# EAGLE schematic WIZ-SM20_005_final (EAGLE 6.5.0)
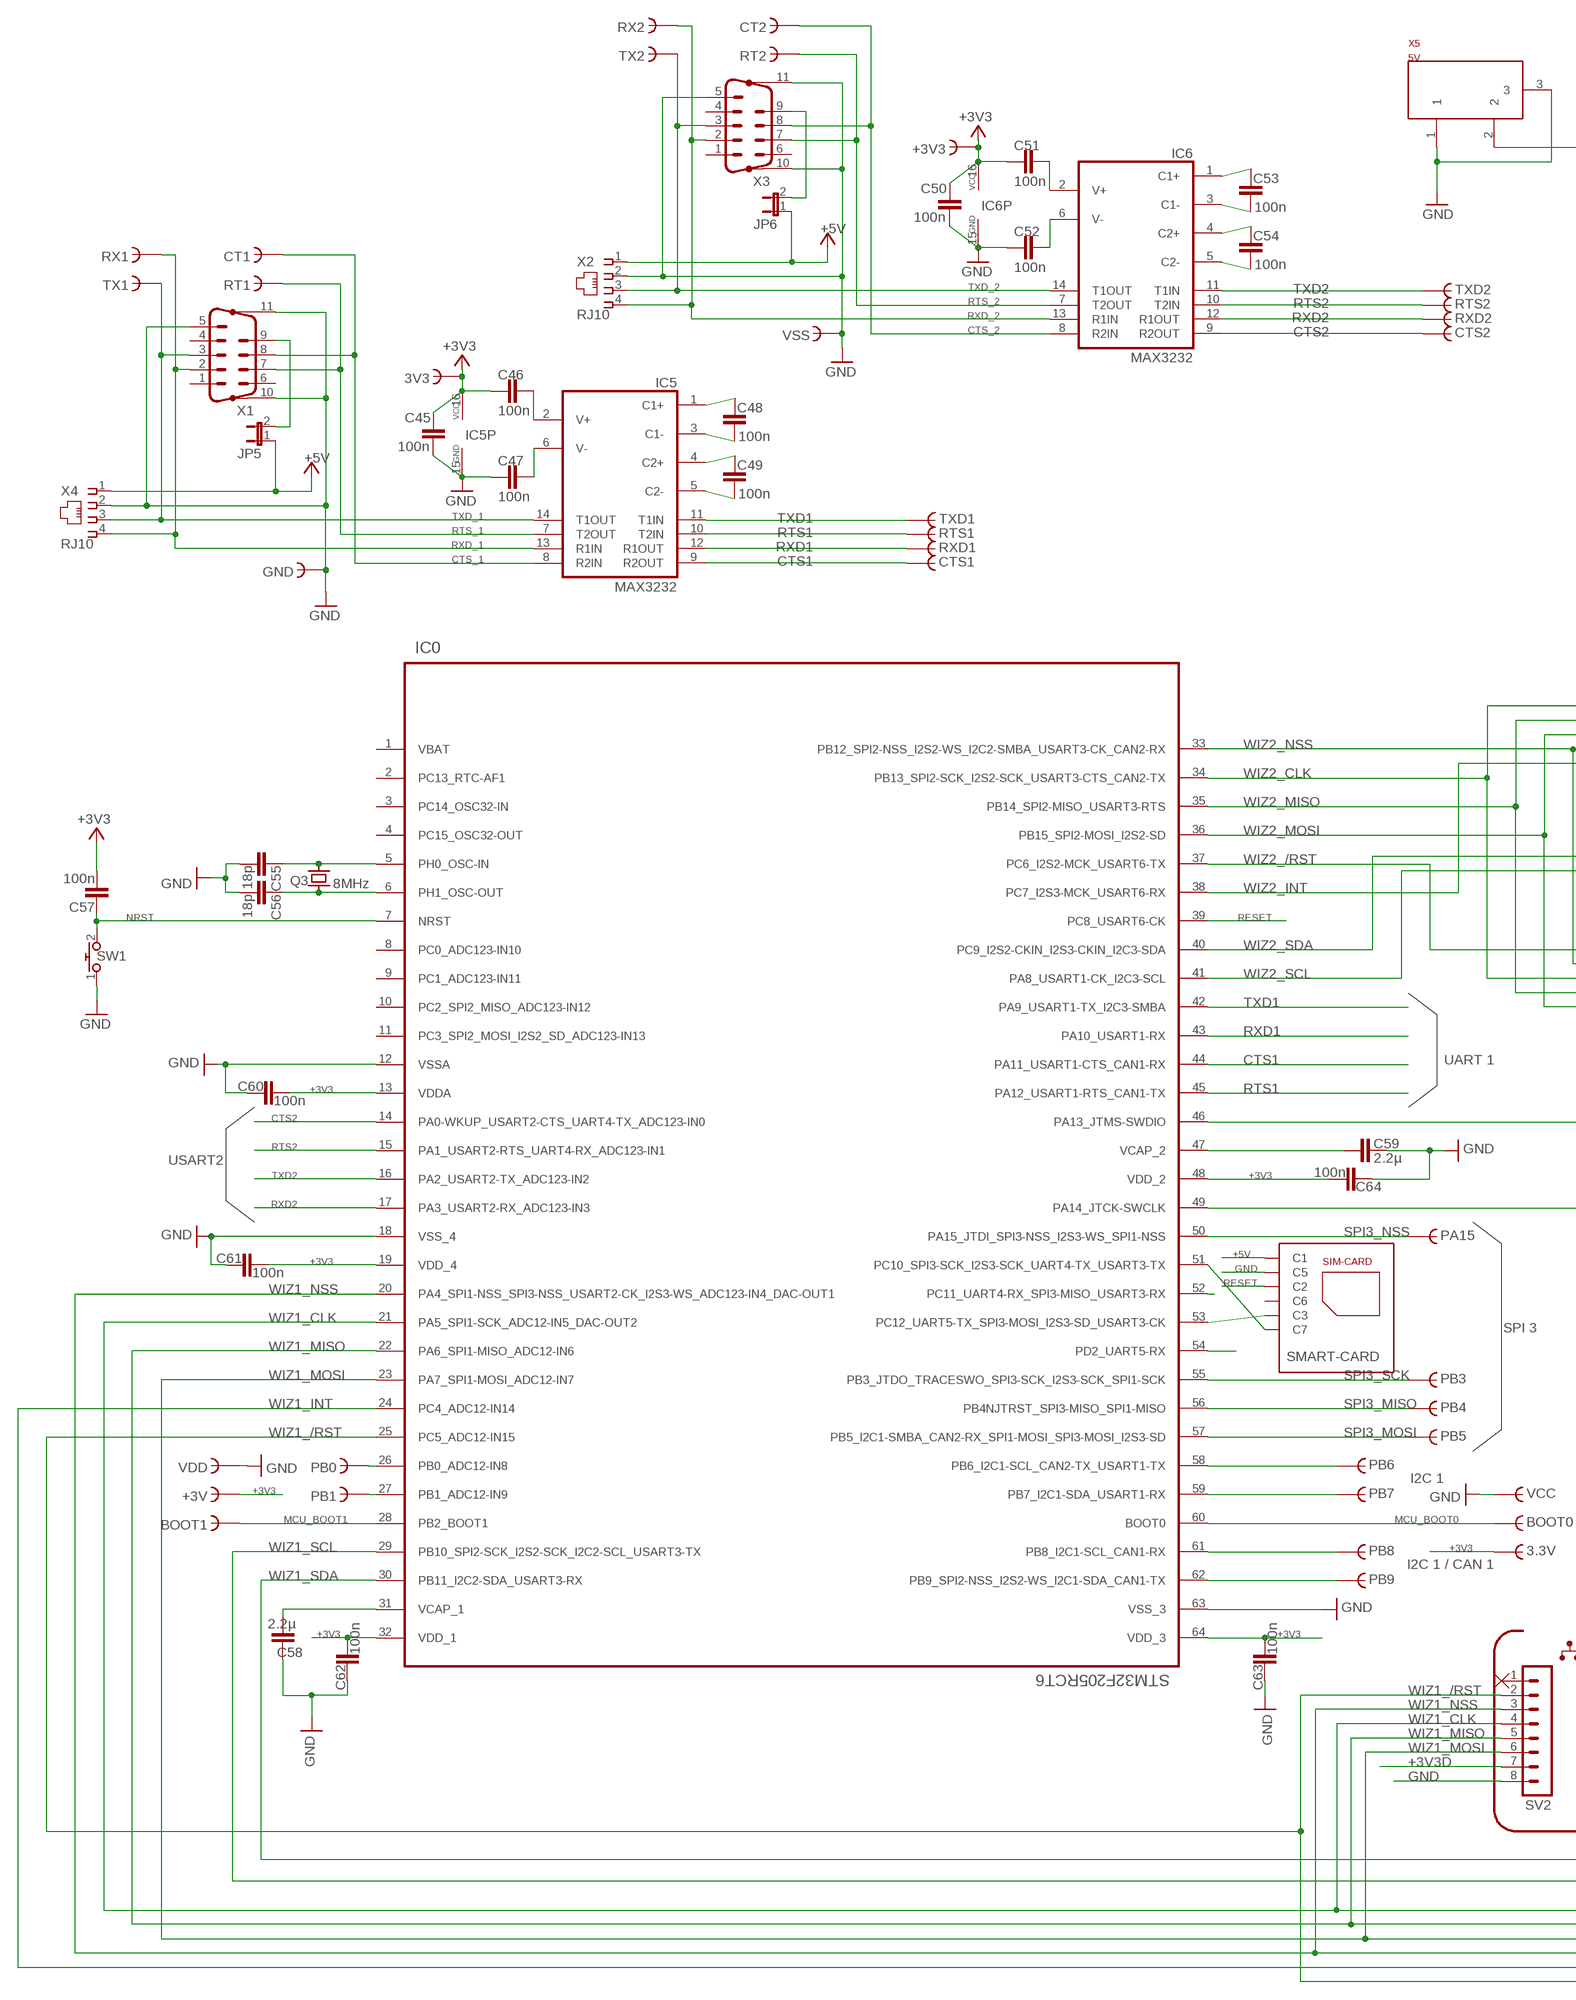
[diagram p0: schematic, sheet 1, part 1 of 2]
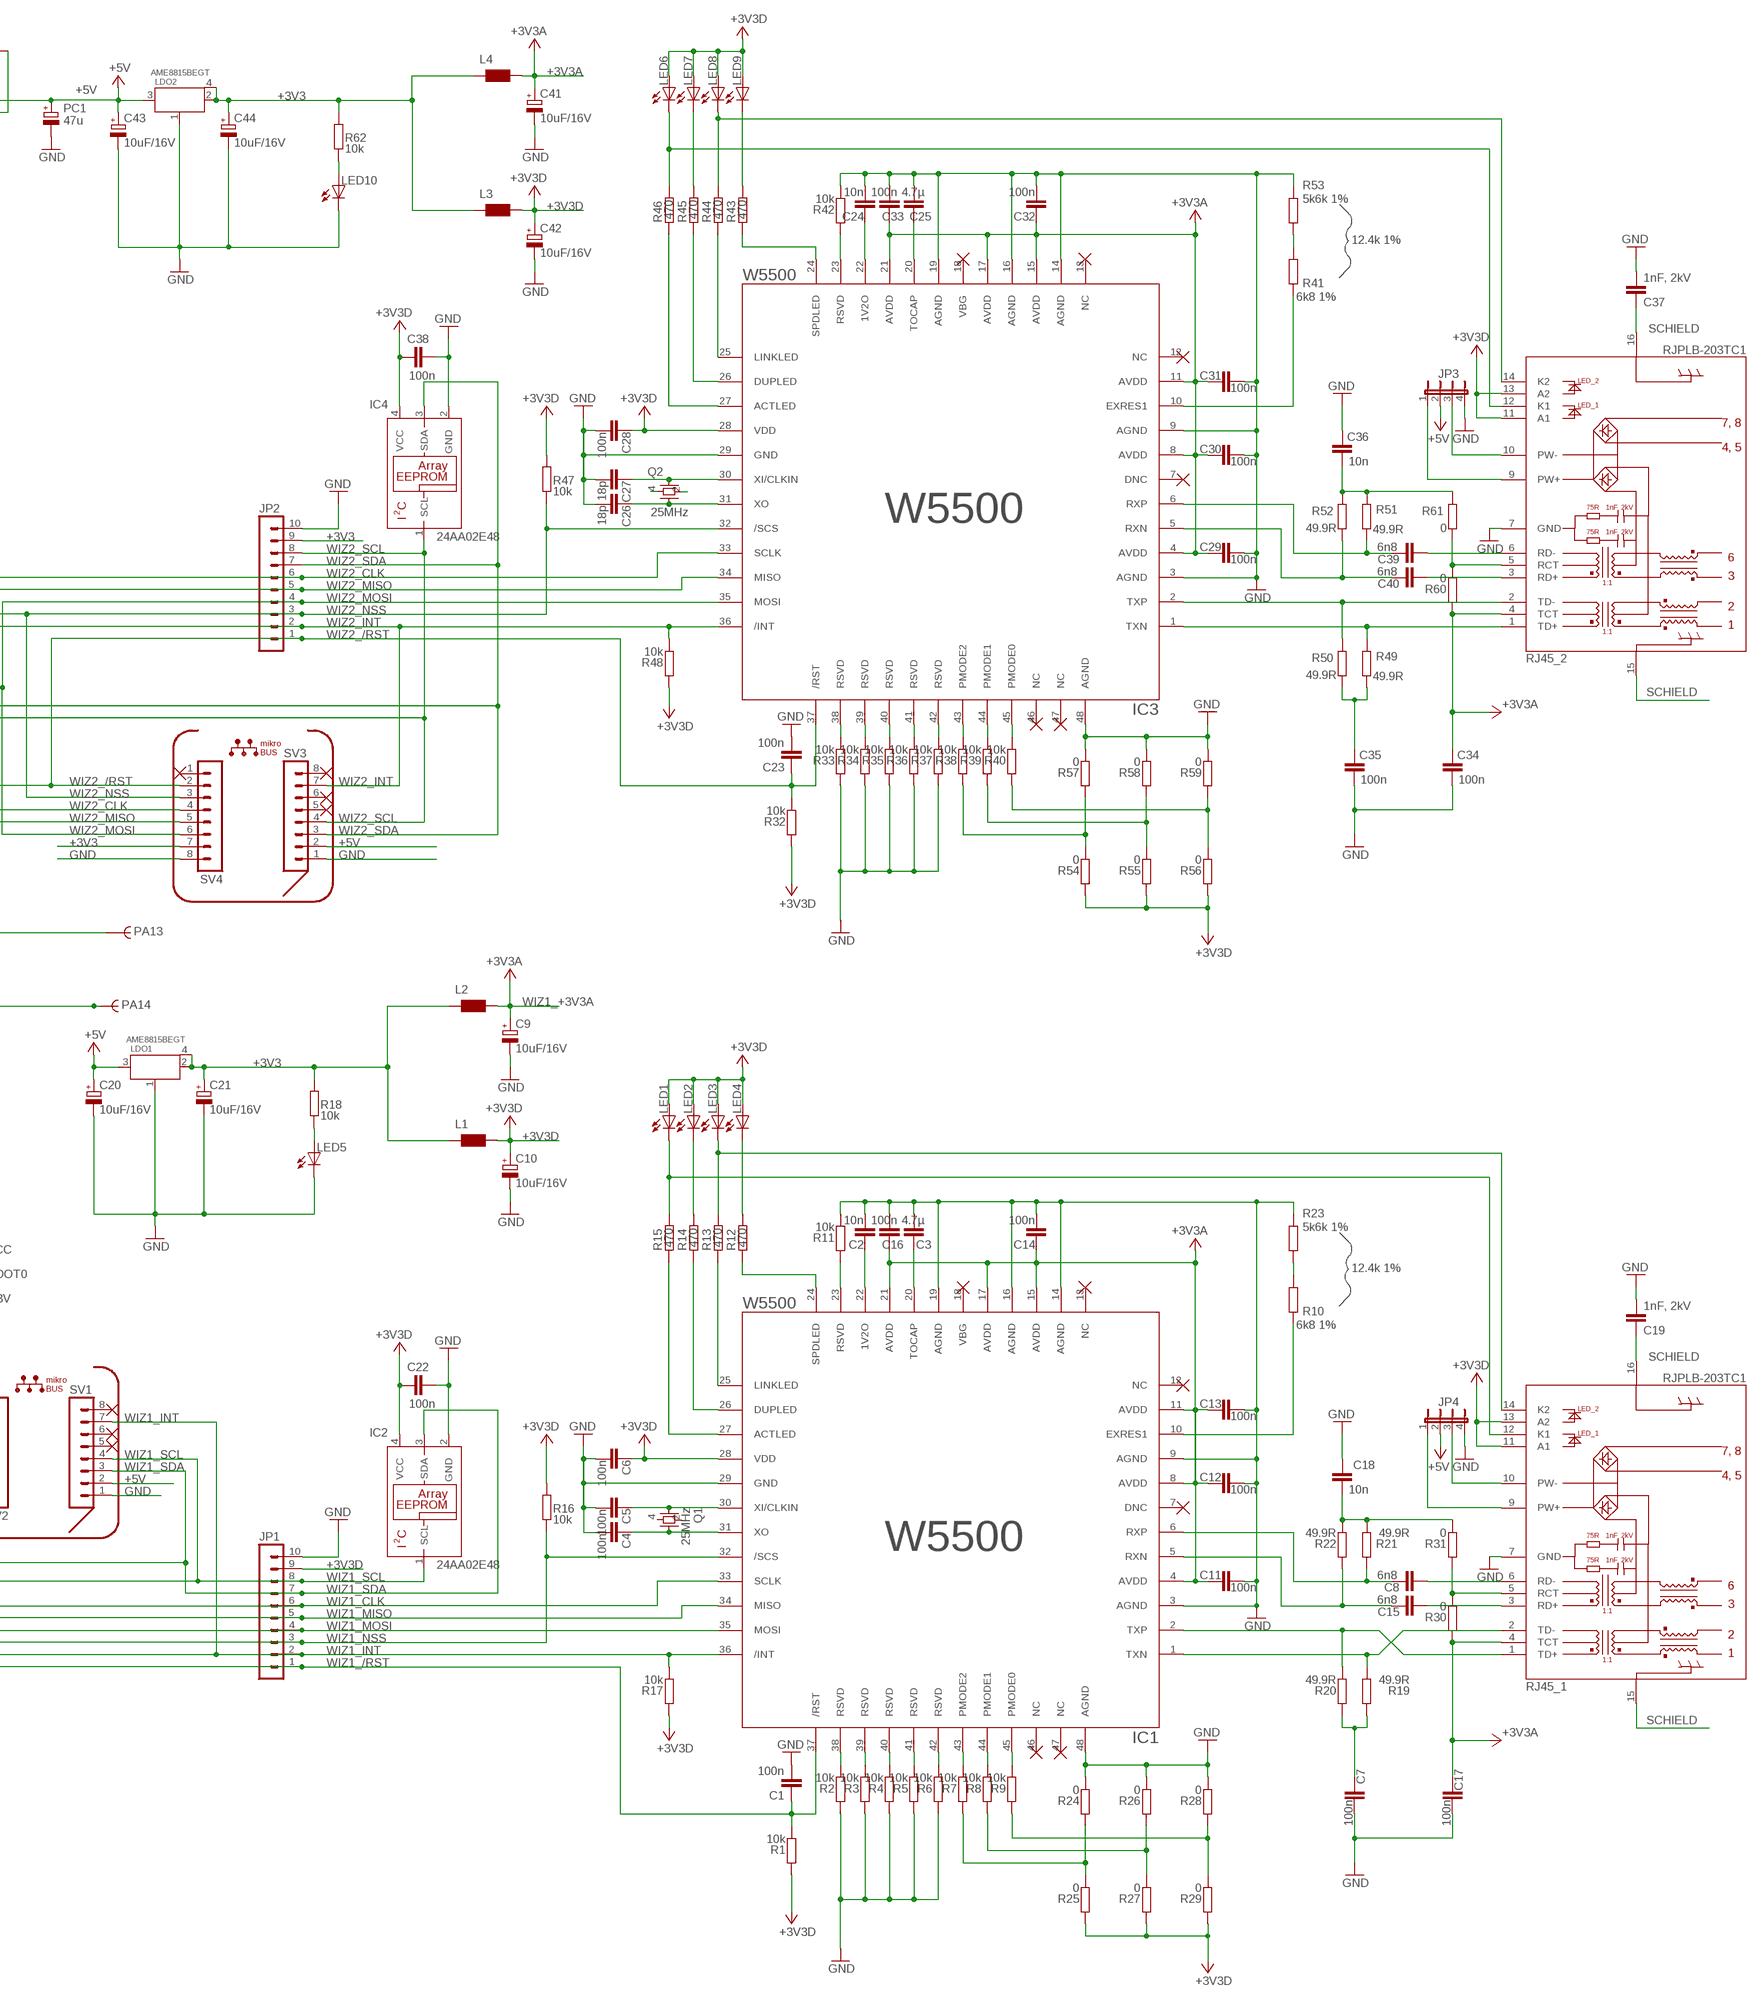
[diagram p1: schematic, sheet 1, part 2 of 2]

## Parts
3.3V  HALFHOLE  [HALFHOLE]
3V3  HALFHOLE  [HALFHOLE]
+3V  HALFHOLE  [HALFHOLE]
+3V3  HALFHOLE  [HALFHOLE]
BOOT0  HALFHOLE  [HALFHOLE]
BOOT1  HALFHOLE  [HALFHOLE]
C1  100n  C-EUC0603K  [C0603K]
C2  10n  C-EUC0402K  [C0402K]
C3  4.7µ  C-EUC0603K  [C0603K]
C4  100n  C-EUC0402K  [C0402K]
C5  100n  C-EUC0402K  [C0402K]
C6  100n  C-EUC0402K  [C0402K]
C7  100n  C-EUC0402K  [C0402K]
C8  6n8  C-EUC0402K  [C0402K]
C9  10uF/16V  CPOL-EUA/3216-18R  [A/3216-18R]
C10  10uF/16V  CPOL-EUA/3216-18R  [A/3216-18R]
C11  100n  C-EUC0402K  [C0402K]
C12  100n  C-EUC0402K  [C0402K]
C13  100n  C-EUC0402K  [C0402K]
C14  100n  C-EUC0402K  [C0402K]
C15  6n8  C-EUC0402K  [C0402K]
C16  100n  C-EUC0402K  [C0402K]
C17  100n  C-EUC0402K  [C0402K]
C18  10n  C-EUC0402K  [C0402K]
C19  1nF, 2kV  C-EUC3216  [C3216]
C20  10uF/16V  CPOL-EUA/3216-18R  [A/3216-18R]
C21  10uF/16V  CPOL-EUA/3216-18R  [A/3216-18R]
C22  100n  C-EUC0402K  [C0402K]
C23  100n  C-EUC0603K  [C0603K]
C24  10n  C-EUC0402K  [C0402K]
C25  4.7µ  C-EUC0603K  [C0603K]
C26  18p  C-EUC0402K  [C0402K]
C27  18p  C-EUC0402K  [C0402K]
C28  100n  C-EUC0402K  [C0402K]
C29  100n  C-EUC0402K  [C0402K]
C30  100n  C-EUC0402K  [C0402K]
C31  100n  C-EUC0402K  [C0402K]
C32  100n  C-EUC0402K  [C0402K]
C33  100n  C-EUC0402K  [C0402K]
C34  100n  C-EUC0402K  [C0402K]
C35  100n  C-EUC0402K  [C0402K]
C36  10n  C-EUC0402K  [C0402K]
C37  1nF, 2kV  C-EUC3216  [C3216]
C38  100n  C-EUC0402K  [C0402K]
C39  6n8  C-EUC0402K  [C0402K]
C40  6n8  C-EUC0402K  [C0402K]
C41  10uF/16V  CPOL-EUA/3216-18R  [A/3216-18R]
C42  10uF/16V  CPOL-EUA/3216-18R  [A/3216-18R]
C43  10uF/16V  CPOL-EUA/3216-18R  [A/3216-18R]
C44  10uF/16V  CPOL-EUA/3216-18R  [A/3216-18R]
C45  100n  C-EUC0402K  [C0402K]
C46  100n  C-EUC0402K  [C0402K]
C47  100n  C-EUC0402K  [C0402K]
C48  100n  C-EUC0402K  [C0402K]
C49  100n  C-EUC0402K  [C0402K]
C50  100n  C-EUC0402K  [C0402K]
C51  100n  C-EUC0402K  [C0402K]
C52  100n  C-EUC0402K  [C0402K]
C53  100n  C-EUC0402K  [C0402K]
C54  100n  C-EUC0402K  [C0402K]
C55  18p  C-EUC0402K  [C0402K]
C56  18p  C-EUC0402K  [C0402K]
C57  100n  C-EUC0402K  [C0402K]
C58  2.2µ  C-EUC0603K  [C0603K]
C59  2.2µ  C-EUC0603K  [C0603K]
C60  100n  C-EUC0402K  [C0402K]
C61  100n  C-EUC0402K  [C0402K]
C62  100n  C-EUC0402K  [C0402K]
C63  100n  C-EUC0402K  [C0402K]
C64  100n  C-EUC0402K  [C0402K]
CT1  HALFHOLE  [HALFHOLE]
CT2  HALFHOLE  [HALFHOLE]
CTS1  HALFHOLE  [HALFHOLE]
CTS2  HALFHOLE  [HALFHOLE]
GND  HALFHOLE  [HALFHOLE]
IC0  STM32F205RCT6  [QFP50P1200X1200X160-64N]
IC1  W5500  [LQFP48]
IC2  24AA02E48  24AA00OT  [SOT23-5L]
IC3  W5500  [LQFP48]
IC4  24AA02E48  24AA00OT  [SOT23-5L]
IC5  MAX3232  MAX232TSSOP16-L  [TSSOP16-L]
IC6  MAX3232  MAX232TSSOP16-L  [TSSOP16-L]
JP1  @ Tessel  MA10-1  [MA10-1]
JP2  @ Tessel  MA10-1  [MA10-1]
JP3  JP4E  [JP4]
JP4  JP4E  [JP4]
JP5  JP1E  [JP1]
JP6  JP1E  [JP1]
L1  WE-CBF_0603  [0603]
L2  WE-CBF_0603  [0603]
L3  WE-CBF_0603  [0603]
L4  WE-CBF_0603  [0603]
LDO1  AME8815BEGT  [SOT223]
LDO2  AME8815BEGT  [SOT223]
LED1  LEDCHIPLED_0603  [CHIPLED_0603]
LED2  LEDCHIPLED_0603  [CHIPLED_0603]
LED3  LEDCHIPLED_0603  [CHIPLED_0603]
LED4  LEDCHIPLED_0603  [CHIPLED_0603]
LED5  LEDCHIPLED_0603  [CHIPLED_0603]
LED6  LEDCHIPLED_0603  [CHIPLED_0603]
LED7  LEDCHIPLED_0603  [CHIPLED_0603]
LED8  LEDCHIPLED_0603  [CHIPLED_0603]
LED9  LEDCHIPLED_0603  [CHIPLED_0603]
LED10  LEDCHIPLED_0603  [CHIPLED_0603]
PA13  HALFHOLE  [HALFHOLE]
PA14  HALFHOLE  [HALFHOLE]
PA15  HALFHOLE  [HALFHOLE]
PB0  HALFHOLE  [HALFHOLE]
PB1  HALFHOLE  [HALFHOLE]
PB3  HALFHOLE  [HALFHOLE]
PB4  HALFHOLE  [HALFHOLE]
PB5  HALFHOLE  [HALFHOLE]
PB6  HALFHOLE  [HALFHOLE]
PB7  HALFHOLE  [HALFHOLE]
PB8  HALFHOLE  [HALFHOLE]
PB9  HALFHOLE  [HALFHOLE]
PC1  47u  CPOL-EUA/3216-18R  [A/3216-18R]
Q1  25MHz  SMD02502-4  [SMD02502-4]
Q2  25MHz  SMD02502-4  [SMD02502-4]
Q3  8MHz  ABM7  [ABM7]
R1  10k  R-EU_R0402  [R0402]
R2  10k  R-EU_R0402  [R0402]
R3  10k  R-EU_R0402  [R0402]
R4  10k  R-EU_R0402  [R0402]
R5  10k  R-EU_R0402  [R0402]
R6  10k  R-EU_R0402  [R0402]
R7  10k  R-EU_R0402  [R0402]
R8  10k  R-EU_R0402  [R0402]
R9  10k  R-EU_R0402  [R0402]
R10  6k8 1%  R-EU_R0402  [R0402]
R11  10k  R-EU_R0402  [R0402]
R12  470  R-EU_R0402  [R0402]
R13  470  R-EU_R0402  [R0402]
R14  470  R-EU_R0402  [R0402]
R15  470  R-EU_R0402  [R0402]
R16  10k  R-EU_R0402  [R0402]
R17  10k  R-EU_R0402  [R0402]
R18  10k  R-EU_R0402  [R0402]
R19  49.9R  R-EU_R0402  [R0402]
R20  49.9R  R-EU_R0402  [R0402]
R21  49.9R  R-EU_R0402  [R0402]
R22  49.9R  R-EU_R0402  [R0402]
R23  5k6k 1%  R-EU_R0402  [R0402]
R24  0  R-EU_R0402  [R0402]
R25  0  R-EU_R0402  [R0402]
R26  0  R-EU_R0402  [R0402]
R27  0  R-EU_R0402  [R0402]
R28  0  R-EU_R0402  [R0402]
R29  0  R-EU_R0402  [R0402]
R30  0  R-EU_R0402  [R0402]
R31  0  R-EU_R0402  [R0402]
R32  10k  R-EU_R0402  [R0402]
R33  10k  R-EU_R0402  [R0402]
R34  10k  R-EU_R0402  [R0402]
R35  10k  R-EU_R0402  [R0402]
R36  10k  R-EU_R0402  [R0402]
R37  10k  R-EU_R0402  [R0402]
R38  10k  R-EU_R0402  [R0402]
R39  10k  R-EU_R0402  [R0402]
R40  10k  R-EU_R0402  [R0402]
R41  6k8 1%  R-EU_R0402  [R0402]
R42  10k  R-EU_R0402  [R0402]
R43  470  R-EU_R0402  [R0402]
R44  470  R-EU_R0402  [R0402]
R45  470  R-EU_R0402  [R0402]
R46  470  R-EU_R0402  [R0402]
R47  10k  R-EU_R0402  [R0402]
R48  10k  R-EU_R0402  [R0402]
R49  49.9R  R-EU_R0402  [R0402]
R50  49.9R  R-EU_R0402  [R0402]
R51  49.9R  R-EU_R0402  [R0402]
R52  49.9R  R-EU_R0402  [R0402]
R53  5k6k 1%  R-EU_R0402  [R0402]
R54  0  R-EU_R0402  [R0402]
R55  0  R-EU_R0402  [R0402]
R56  0  R-EU_R0402  [R0402]
R57  0  R-EU_R0402  [R0402]
R58  0  R-EU_R0402  [R0402]
R59  0  R-EU_R0402  [R0402]
R60  0  R-EU_R0402  [R0402]
R61  0  R-EU_R0402  [R0402]
R62  10k  R-EU_R0402  [R0402]
RJ45_1  RJPLB-203TC1  [RJPLB-203]
RJ45_2  RJPLB-203TC1  [RJPLB-203]
RT1  HALFHOLE  [HALFHOLE]
RT2  HALFHOLE  [HALFHOLE]
RTS1  HALFHOLE  [HALFHOLE]
RTS2  HALFHOLE  [HALFHOLE]
RX1  HALFHOLE  [HALFHOLE]
RX2  HALFHOLE  [HALFHOLE]
RXD1  HALFHOLE  [HALFHOLE]
RXD2  HALFHOLE  [HALFHOLE]
SMART-CARD  7111S2015X02LF  [7111S2015X02LF]
SV1  MA08-1  [MA08-1]
SV2  MA08-1  [MA08-1]
SV3  MA08-1  [MA08-1]
SV4  MA08-1  [MA08-1]
SW1  Reset  PHAP3361  [1302]
TX1  HALFHOLE  [HALFHOLE]
TX2  HALFHOLE  [HALFHOLE]
TXD1  HALFHOLE  [HALFHOLE]
TXD2  HALFHOLE  [HALFHOLE]
VCC  HALFHOLE  [HALFHOLE]
VDD  HALFHOLE  [HALFHOLE]
VSS  HALFHOLE  [HALFHOLE]
X1  M09HPSLIM_SMD  [NORCOMP_SMD]
X2  RJ10  520249-2  [520249-2]
X3  M09HPSLIM_SMD  [NORCOMP_SMD]
X4  RJ10  520249-2  [520249-2]
X5  5V  POWERSUPPLY_DC21MMX  [POWERSUPPLY_DC-21MM]

## Nets
+3V3: 3.3V.P$1 3V3.P$1 +3V3.P$1 +3V.P$1 C21.+ C44.+ C45.2 C46.1 C50.2 C51.1 C60.2 C61.2 C62.2 C63.2 C64.2 IC0.13(VDDA) IC0.19(VDD_4) IC0.32(VDD_1) IC0.48(VDD_2) IC0.64(VDD_3) IC5.16(VCC) IC6.16(VCC) JP2.9 L1.2 L2.2 L3.2 L4.2 LDO1.2 LDO1.4 LDO2.2 LDO2.4 R18.2 R62.2 SV4.7
+3V3A: C29.1 C30.1 C31.1 C32.1 C33.1 C34.1 C41.+ IC3.4(AVDD) IC3.8(AVDD) IC3.11(AVDD) IC3.15(AVDD) IC3.17(AVDD) IC3.21(AVDD) L4.1 R60.2 RJ45_2.4(TCT)
+3V3D: C6.1 C10.+ C22.1 C28.1 C38.1 C42.+ IC1.28(VDD) IC2.4(VCC) IC3.28(VDD) IC4.4(VCC) JP1.9 L1.1 L3.1 LED1.A LED2.A LED3.A LED4.A LED6.A LED7.A LED8.A LED9.A R1.2 R16.2 R17.2 R25.2 R27.2 R29.2 R32.2 R47.2 R48.2 R54.2 R55.2 R56.2 RJ45_1.11(A1) RJ45_1.13(A2) RJ45_2.11(A1) RJ45_2.13(A2) SV2.7
+5V: C20.+ C43.+ JP3.2 JP4.2 JP5.1 JP6.1 LDO1.3 LDO2.3 PC1.+ SMART-CARD.C1 SV1.2 SV3.2 X2.1 X4.1 X5.2
ACTLED: IC1.27(ACTLED) R15.1
ACTLED1: IC3.27(ACTLED) R46.1
CTS1: CTS1.P$1 IC0.44(PA11_USART1-CTS_CAN1-RX) IC5.9(R2OUT)
CTS2: CTS2.P$1 IC0.14(PA0-WKUP_USART2-CTS_UART4-TX_ADC123-IN0) IC6.9(R2OUT)
CTS_1: CT1.P$1 IC5.8(R2IN) X1.8
CTS_2: CT2.P$1 IC6.8(R2IN) X3.8
GND: C1.2 C2.2 C3.2 C4.2 C5.2 C6.2 C7.2 C9.- C10.- C11.2 C12.2 C13.2 C14.2 C16.2 C17.2 C18.2 C19.2 C20.- C21.- C22.2 C23.2 C24.2 C25.2 C26.2 C27.2 C28.2 C29.2 C30.2 C31.2 C32.2 C33.2 C34.2 C35.2 C36.2 C37.2 C38.2 C41.- C42.- C43.- C44.- C45.1 C47.1 C50.1 C52.1 C55.2 C56.2 C58.1 C59.1 C60.1 C61.1 C62.1 C63.1 C64.1 GND.P$1 IC0.12(VSSA) IC0.18(VSS_4) IC0.63(VSS_3) IC1.3(AGND) IC1.9(AGND) IC1.14(AGND) IC1.16(AGND) IC1.19(AGND) IC1.29(GND) IC1.48(AGND) IC2.2(GND) IC3.3(AGND) IC3.9(AGND) IC3.14(AGND) IC3.16(AGND) IC3.19(AGND) IC3.29(GND) IC3.48(AGND) IC4.2(GND) IC5.15(GND) IC6.15(GND) JP1.10 JP2.10 JP3.4 JP4.4 LDO1.1 LDO2.1 LED5.C LED10.C PC1.- Q2.2(PD1) Q2.4(PD2) R2.2 R3.2 R4.2 R5.2 R6.2 R11.1 R23.1 R24.1 R26.1 R28.1 R33.2 R34.2 R35.2 R36.2 R37.2 R42.1 R53.1 R57.1 R58.1 R59.1 RJ45_1.7(GND) RJ45_2.7(GND) SMART-CARD.C5 SV1.1 SV2.8 SV3.1 SV4.8 SW1.1 VCC.P$1 VDD.P$1 VSS.P$1 X1.5 X1.10(G1) X1.11(G2) X2.2 X3.5 X3.10(G1) X3.11(G2) X4.2 X5.1 X5.3
MCU_BOOT0: BOOT0.P$1 IC0.60(BOOT0)
MCU_BOOT1: BOOT1.P$1 IC0.28(PB2_BOOT1)
N$1: C8.1 RJ45_1.6(RD-)
N$2: C15.1 RJ45_1.3(RD+)
N$3: IC3.38(RSVD) R33.1
N$4: IC1.25(LINKLED) R13.1
N$5: R10.1 R23.2
N$6: IC3.39(RSVD) R34.1
N$7: IC3.40(RSVD) R35.1
N$8: IC3.41(RSVD) R36.1
N$9: IC1.23(RSVD) R11.2
N$10: IC1.38(RSVD) R2.1
N$11: IC1.39(RSVD) R3.1
N$12: IC1.40(RSVD) R4.1
N$13: IC1.41(RSVD) R5.1
N$14: IC1.42(RSVD) R6.1
N$15: IC1.43(PMODE2) R7.1
N$16: IC1.44(PMODE1) R8.1
N$17: IC1.45(PMODE0) R9.1
N$18: R9.2 R28.2 R29.1
N$19: R8.2 R26.2 R27.1
N$20: R7.2 R24.2 R25.1
N$21: IC3.42(RSVD) R37.1
N$22: IC1.10(EXRES1) R10.2
N$23: C2.1 IC1.22(1V2O)
N$24: C3.1 IC1.20(TOCAP)
N$25: IC1.24(SPDLED) R12.1
N$26: IC1.26(DUPLED) R14.1
N$27: IC3.43(PMODE2) R38.1
N$28: LED4.C R12.2
N$29: LED1.C R15.2 RJ45_1.12(K1)
N$30: LED2.C R14.2
N$31: LED3.C R13.2 RJ45_1.14(K2)
N$32: C4.1 IC1.31(XO) Q1.3
N$33: C5.1 IC1.30(XI/CLKIN) Q1.1
N$34: LED5.A R18.1
N$35: C7.1 R19.2 R20.2
N$36: C18.1 R21.1 R22.1 R31.1
N$37: IC3.44(PMODE1) R39.1
N$38: IC3.45(PMODE0) R40.1
N$39: IC3.10(EXRES1) R41.2
N$40: IC3.23(RSVD) R42.2
N$41: C24.1 IC3.22(1V2O)
N$42: C25.1 IC3.20(TOCAP)
N$43: IC3.24(SPDLED) R43.1
N$44: IC3.26(DUPLED) R45.1
N$45: LED9.C R43.2
N$46: LED6.C R46.2 RJ45_2.12(K1)
N$47: LED7.C R45.2
N$48: LED8.C R44.2 RJ45_2.14(K2)
N$49: C26.1 IC3.31(XO) Q2.3
N$50: C27.1 IC3.30(XI/CLKIN) Q2.1
N$51: C35.1 R49.2 R50.2
N$52: C36.1 R51.1 R52.1 R61.1
N$53: IC3.25(LINKLED) R44.1
N$54: R41.1 R53.2
N$55: R38.2 R54.1 R57.2
N$56: R39.2 R55.1 R58.2
N$57: R40.2 R56.1 R59.2
N$58: IC0.46(PA13_JTMS-SWDIO) PA13.P$1
N$59: IC0.49(PA14_JTCK-SWCLK) PA14.P$1
N$60: LED10.A R62.1
N$65: IC0.51(PC10_SPI3-SCK_I2S3-SCK_UART4-TX_USART3-TX) SMART-CARD.C7
N$66: IC0.52(PC11_UART4-RX_SPI3-MISO_USART3-RX)
N$67: C55.1 IC0.5(PH0_OSC-IN) Q3.1
N$68: C56.1 IC0.6(PH1_OSC-OUT) Q3.2
N$69: IC0.26(PB0_ADC12-IN8) PB0.P$1
N$70: IC0.27(PB1_ADC12-IN9) PB1.P$1
N$71: IC0.53(PC12_UART5-TX_SPI3-MOSI_I2S3-SD_USART3-CK) SMART-CARD.C3
N$72: IC0.61(PB8_I2C1-SCL_CAN1-RX) PB8.P$1
N$73: IC0.62(PB9_SPI2-NSS_I2S2-WS_I2C1-SDA_CAN1-TX) PB9.P$1
N$74: IC0.58(PB6_I2C1-SCL_CAN2-TX_USART1-TX) PB6.P$1
N$78: C53.2 IC6.1(C1+)
N$79: IC0.54(PD2_UART5-RX)
N$80: C48.2 IC5.1(C1+)
N$81: C48.1 IC5.3(C1-)
N$82: C49.2 IC5.4(C2+)
N$83: C49.1 IC5.5(C2-)
N$84: C46.2 IC5.2(V+)
N$85: C47.2 IC5.6(V-)
N$86: C53.1 IC6.3(C1-)
N$87: C54.2 IC6.4(C2+)
N$88: C54.1 IC6.5(C2-)
N$89: C51.2 IC6.2(V+)
N$90: JP5.2 X1.9
N$91: C52.2 IC6.6(V-)
N$92: IC0.59(PB7_I2C1-SDA_USART1-RX) PB7.P$1
N$95: JP6.2 X3.9
N$98: C58.2 IC0.31(VCAP_1)
N$99: C59.2 IC0.47(VCAP_2)
NRST: C57.1 IC0.7(NRST) SW1.2
POE+: JP4.1 RJ45_1.9(PW+)
POE+1: JP3.1 RJ45_2.9(PW+)
POE-: JP4.3 RJ45_1.10(PW-)
POE-1: JP3.3 RJ45_2.10(PW-)
RCT: R30.1 R31.2 RJ45_1.5(RCT)
RCT1: R60.1 R61.2 RJ45_2.5(RCT)
RESET: IC0.39(PC8_USART6-CK) SMART-CARD.C2
RTS1: IC0.45(PA12_USART1-RTS_CAN1-TX) IC5.10(T2IN) RTS1.P$1
RTS2: IC0.15(PA1_USART2-RTS_UART4-RX_ADC123-IN1) IC6.10(T2IN) RTS2.P$1
RTS_1: IC5.7(T2OUT) RT1.P$1 X1.7
RTS_2: IC6.7(T2OUT) RT2.P$1 X3.7
RX2_N: C39.1 RJ45_2.6(RD-)
RX2_P: C40.1 RJ45_2.3(RD+)
RXD1: IC0.43(PA10_USART1-RX) IC5.12(R1OUT) RXD1.P$1
RXD2: IC0.17(PA3_USART2-RX_ADC123-IN3) IC6.12(R1OUT) RXD2.P$1
RXD_1: IC5.13(R1IN) RX1.P$1 X1.2 X4.4
RXD_2: IC6.13(R1IN) RX2.P$1 X2.4 X3.2
RXN: C8.2 IC1.6(RXP) R21.2
RXN1: C39.2 IC3.6(RXP) R51.2
RXP: C15.2 IC1.5(RXN) R22.2
RXP1: C40.2 IC3.5(RXN) R52.2
SCHIELD: C19.1 C37.1 RJ45_1.15(SCHIELD_1) RJ45_1.16(SCHIELD_2) RJ45_2.15(SCHIELD_1) RJ45_2.16(SCHIELD_2)
SPI3_MISO: IC0.56(PB4NJTRST_SPI3-MISO_SPI1-MISO) PB4.P$1
SPI3_MOSI: IC0.57(PB5_I2C1-SMBA_CAN2-RX_SPI1-MOSI_SPI3-MOSI_I2S3-SD) PB5.P$1
SPI3_NSS: IC0.50(PA15_JTDI_SPI3-NSS_I2S3-WS_SPI1-NSS) PA15.P$1
SPI3_SCK: IC0.55(PB3_JTDO_TRACESWO_SPI3-SCK_I2S3-SCK_SPI1-SCK) PB3.P$1
TX2_N: IC3.2(TXP) R50.1 RJ45_2.2(TD-)
TX2_P: IC3.1(TXN) R49.1 RJ45_2.1(TD+)
TXD1: IC0.42(PA9_USART1-TX_I2C3-SMBA) IC5.11(T1IN) TXD1.P$1
TXD2: IC0.16(PA2_USART2-TX_ADC123-IN2) IC6.11(T1IN) TXD2.P$1
TXD_1: IC5.14(T1OUT) TX1.P$1 X1.3 X4.3
TXD_2: IC6.14(T1OUT) TX2.P$1 X2.3 X3.3
TXN: IC1.2(TXP) R20.1 RJ45_1.1(TD+)
TXP: IC1.1(TXN) R19.1 RJ45_1.2(TD-)
VCC: C57.2 ; supply symbol labelled +3V3
WIZ1_+3V3A: C9.+ C11.1 C12.1 C13.1 C14.1 C16.1 C17.1 IC1.4(AVDD) IC1.8(AVDD) IC1.11(AVDD) IC1.15(AVDD) IC1.17(AVDD) IC1.21(AVDD) L2.1 R30.2 RJ45_1.4(TCT) ; supply symbol labelled +3V3A
WIZ1_/RST: C1.1 IC0.25(PC5_ADC12-IN15) IC1.37(/RST) JP1.1 R1.1 SV2.2
WIZ1_CLK: IC0.21(PA5_SPI1-SCK_ADC12-IN5_DAC-OUT2) IC1.33(SCLK) JP1.6 SV2.4
WIZ1_INT: IC0.24(PC4_ADC12-IN14) IC1.36(/INT) JP1.2 R17.1 SV1.7
WIZ1_MISO: IC0.22(PA6_SPI1-MISO_ADC12-IN6) IC1.34(MISO) JP1.5 SV2.5
WIZ1_MOSI: IC0.23(PA7_SPI1-MOSI_ADC12-IN7) IC1.35(MOSI) JP1.4 SV2.6
WIZ1_NSS: IC0.20(PA4_SPI1-NSS_SPI3-NSS_USART2-CK_I2S3-WS_ADC123-IN4_DAC-OUT1) IC1.32(/SCS) JP1.3 R16.1 SV2.3
WIZ1_SCL: IC0.29(PB10_SPI2-SCK_I2S2-SCK_I2C2-SCL_USART3-TX) IC2.1(SCL) JP1.8 SV1.4
WIZ1_SDA: IC0.30(PB11_I2C2-SDA_USART3-RX) IC2.3(SDA) JP1.7 SV1.3
WIZ2_/RST: C23.1 IC0.37(PC6_I2S2-MCK_USART6-TX) IC3.37(/RST) JP2.1 R32.1 SV4.2
WIZ2_CLK: IC0.34(PB13_SPI2-SCK_I2S2-SCK_USART3-CTS_CAN2-TX) IC3.33(SCLK) JP2.6 SV4.4
WIZ2_INT: IC0.38(PC7_I2S3-MCK_USART6-RX) IC3.36(/INT) JP2.2 R48.1 SV3.7
WIZ2_MISO: IC0.35(PB14_SPI2-MISO_USART3-RTS) IC3.34(MISO) JP2.5 SV4.5
WIZ2_MOSI: IC0.36(PB15_SPI2-MOSI_I2S2-SD) IC3.35(MOSI) JP2.4 SV4.6
WIZ2_NSS: IC0.33(PB12_SPI2-NSS_I2S2-WS_I2C2-SMBA_USART3-CK_CAN2-RX) IC3.32(/SCS) JP2.3 R47.1 SV4.3
WIZ2_SCL: IC0.41(PA8_USART1-CK_I2C3-SCL) IC4.1(SCL) JP2.8 SV3.4
WIZ2_SDA: IC0.40(PC9_I2S2-CKIN_I2S3-CKIN_I2C3-SDA) IC4.3(SDA) JP2.7 SV3.3
Unconnected: IC0.2(PC13_RTC-AF1) IC0.3(PC14_OSC32-IN) IC0.4(PC15_OSC32-OUT) IC0.8(PC0_ADC123-IN10) IC0.9(PC1_ADC123-IN11) IC0.10(PC2_SPI2_MISO_ADC123-IN12) IC0.11(PC3_SPI2_MOSI_I2S2_SD_ADC123-IN13) IC1.7(DNC) IC1.12(NC) IC1.13(NC) IC1.18(VBG) IC1.46(NC) IC1.47(NC) IC3.7(DNC) IC3.12(NC) IC3.13(NC) IC3.18(VBG) IC3.46(NC) IC3.47(NC) Q1.2(PD1) Q1.4(PD2) SMART-CARD.C6 SV1.5 SV1.6 SV1.8 SV2.1 SV3.5 SV3.6 SV3.8 SV4.1 X1.1 X1.4 X1.6 X3.1 X3.4 X3.6

## Notes on the sheet
- 12.4k 1%
- W5500
- mikro
  BUS
- UART 1
- USART2
- SPI 3
- I2C 1
- 12.4k 1%
- I2C 1 / CAN 1
- mikro
  BUS
- W5500

## Power pins joined to a net without a drawn wire
VBAT: IC0.1(VBAT)

## Library data of the parts
3.3V 3V3 +3V +3V3 BOOT0 BOOT1 CT1 CT2 CTS1 CTS2 GND PA13-PA15 PB0 PB1 PB3-PB9 RT1 RT2 RTS1 RTS2 RX1 RX2 RXD1 RXD2 TX1 TX2 TXD1 TXD2 VCC VDD VSS = 02_ethernet_580:HALFHOLE
C1-C8 C11-C19 C22-C40 C45-C64 = resistor:C-EU: CAPACITOR, European symbol
C9 C10 C20 C21 C41-C44 PC1 = resistor:CPOL-EU: POLARIZED CAPACITOR, European symbol
IC0 = STM32F205_64QFP:STM32F205RCT6: ARM-based 32-bit MCU,LQFP-64; MPN: STM32F205RCT6; OC_FARNELL: 2060896; OC_NEWARK: 47T9328; PACKAGE: LQFP-64; SUPPLIER: STMICROELECTRONICS
IC1 IC3 = _wiznet_2013-08-18:W5500: W5500: WIZnet Hardwired TCP/IP + MAC + PHY - Internet Interface Chip
IC2 IC4 = microchip:24*00: Serial EEPROM 128 bit, I2C (AA = 1.8 V/LC = 2.5 V/C = 5.0 V); MF: MICROCHIP; MPN: 24AA00T-I/OTG; OC_FARNELL: 1331264; OC_NEWARK: 89H3038
IC5 IC6 = maxim:MAX232: RS232 TRANSCEIVER
JP1 JP2 = con-lstb:MA10-1: PIN HEADER; OC_FARNELL: unknown; OC_NEWARK: unknown
JP3 JP4 = jumper:JP4E: JUMPER
JP5 JP6 = jumper:JP1E: JUMPER
L1-L4 = wuerth-elektronik:WE-CBF: SMD EMI Suppression Ferrite Beads - excellent anti-EMI properties - low DCR - impedances till 3000 ohms - rated current up to 6 A
LDO1 LDO2 = _wiznet_2013-08-18:AME8815BEGT
LED1-LED10 = led:LED: LED OSRAM: - CHIPLED LG R971, LG N971, LY N971, LG Q971, LY Q971, LO R971, LY R971 LH N974, LH R974 LS Q976, LO Q976, LY Q976 LO Q996 - Hyper CHIPLED LW Q18S LB Q993, LB Q99A, LB R99A - SideLED LS A670, LO A670, LY A670, LG A670, LP A670 LB A673, LV A673, LT A673, LW A673 LH A674 LY A675 LS A676, LA A676, LO A676, LY A676, LW A676 LS A679, LY A679, LG A679 - Hyper Micro SIDELED® LS Y876, LA Y876, LO Y876, LY Y876 LT Y87S - SmartLED LW L88C, LW L88S LB L89C, LB L89S, LG L890 LS L89K, LO L89K, LY L89K LS L896, LA L896, LO L896, LY L896 - TOPLED LS T670, LO T670, LY T670, LG T670, LP T670 LSG T670, LSP T670, LSY T670, LOP T670, LYG T670 LG T671, LOG T671, LSG T671 LB T673, LV T673, LT T673, LW T673 LH T674 LS T676, LA T676, LO T676, LY T676, LB T676, LH T676, LSB T676, LW T676 LB T67C, LV T67C, LT T67C, LS T67K, LO T67K, LY T67K, LW E67C LS E67B, LA E67B, LO E67B, LY E67B, LB E67C, LV E67C, LT E67C LW T67C LS T679, LY T679, LG T679 LS T770, LO T770, LY T770, LG T770, LP T770 LB T773, LV T773, LT T773, LW T773 LH T774 LS E675, LA E675, LY E675, LS T675 LS T776, LA T776, LO T776, LY T776, LB T776 LHGB T686 LT T68C, LB T68C - Hyper Mini TOPLED® LB M676 - Mini TOPLED Santana® LG M470 LS M47K, LO M47K, LY M47K Source: http://www.osram.convergy.de LUXEON: - LUMILED® LXK2-PW12-R00, LXK2-PW12-S00, LXK2-PW14-U00, LXK2-PW14-V00 LXK2-PM12-R00, LXK2-PM12-S00, LXK2-PM14-U00 LXK2-PE12-Q00, LXK2-PE12-R00, LXK2-PE12-S00, LXK2-PE14-T00, LXK2-PE14-U00 LXK2-PB12-K00, LXK2-PB12-L00, LXK2-PB12-M00, LXK2-PB14-N00, LXK2-PB14-P00, LXK2-PB14-Q00 LXK2-PR12-L00, LXK2-PR12-M00, LXK2-PR14-Q00, LXK2-PR14-R00 LXK2-PD12-Q00, LXK2-PD12-R00, LXK2-PD12-S00 LXK2-PH12-R00, LXK2-PH12-S00 LXK2-PL12-P00, LXK2-PL12-Q00, LXK2-PL12-R00 Source: www.luxeon.com KINGBRIGHT: KA-3528ASYC Source: www.kingbright.com
Q1 Q2 = Petermann_5_11_0:SMD02502-4
Q3 = Petermann_5_11_0:ABM7: ABRACON - ABM7-8.000MHZ-D2Y-T - QUARZ, 8MHZ, 18PF, SMD http://de.farnell.com/abracon/abm7-8-000mhz-d2-t/quarz-8mhz-18pf-smd/dp/2101337
R1-R62 = resistor:R-EU_: RESISTOR, European symbol
RJ45_1 RJ45_2 = Taimag:RJPLB-203TC1
SMART-CARD = con-fci:7111S2015X02LF
SV1-SV4 = con-lstb:MA08-1: PIN HEADER; OC_FARNELL: unknown; OC_NEWARK: unknown
SW1 = 04_CoreRiver:PHAP3361
X1 X3 = con-subd:M09HP: SUB-D
X2 X4 = con-amp:520249-2: AMP connector
X5 = SmartPrj:POWERSUPPLY_DC21MM